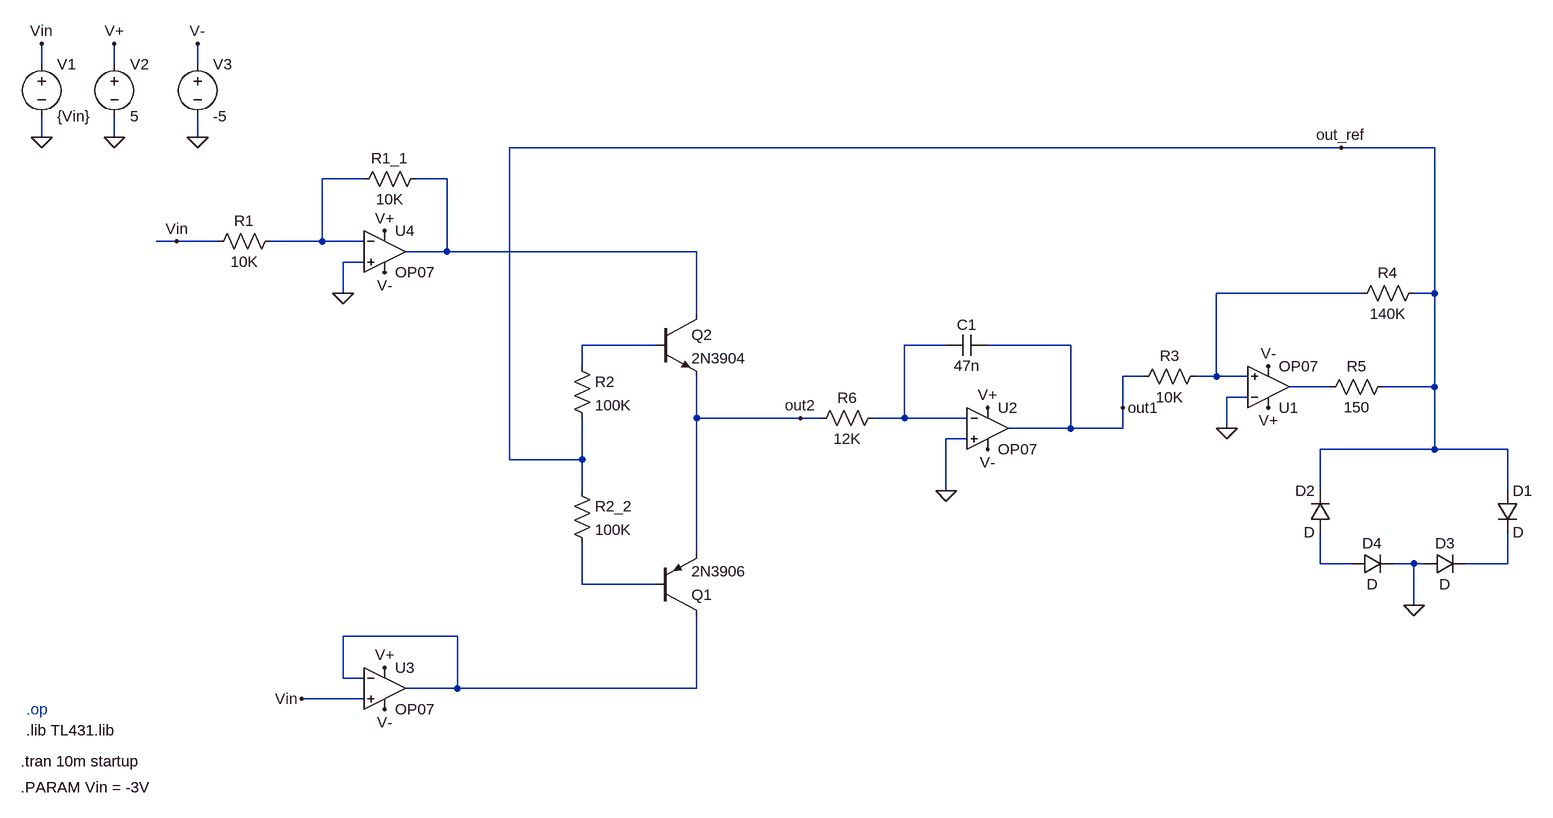
[diagram p0: schematic Proiect.asc]
Proiect.asc, the LTspice schematic file:
Version 4
SHEET 1 1724 1008
WIRE -608 -160 -608 -192
WIRE -496 -160 -496 -192
WIRE -368 -160 -368 -192
WIRE -608 -48 -608 -80
WIRE -496 -48 -496 -80
WIRE -368 -48 -368 -80
WIRE 1392 -32 112 -32
WIRE 1536 -32 1392 -32
WIRE -112 16 -176 16
WIRE 16 16 -32 16
WIRE -400 112 -432 112
WIRE -336 112 -400 112
WIRE -176 112 -176 16
WIRE -176 112 -256 112
WIRE -112 112 -176 112
WIRE 16 128 16 16
WIRE 16 128 -48 128
WIRE 400 128 16 128
WIRE -112 144 -144 144
WIRE -144 192 -144 144
WIRE 1424 192 1200 192
WIRE 1536 192 1536 -32
WIRE 1536 192 1504 192
WIRE 400 224 400 128
WIRE 336 272 224 272
WIRE 784 272 720 272
WIRE 976 272 848 272
WIRE 224 304 224 272
WIRE 1088 320 1056 320
WIRE 1200 320 1200 192
WIRE 1200 320 1168 320
WIRE 1248 320 1200 320
WIRE 1376 336 1312 336
WIRE 1536 336 1536 192
WIRE 1536 336 1456 336
WIRE 1248 352 1216 352
WIRE 1056 368 1056 320
WIRE 400 384 400 320
WIRE 560 384 400 384
WIRE 592 384 560 384
WIRE 720 384 720 272
WIRE 720 384 672 384
WIRE 816 384 720 384
WIRE 976 400 976 272
WIRE 976 400 880 400
WIRE 1056 400 1056 368
WIRE 1056 400 976 400
WIRE 1216 400 1216 352
WIRE 816 416 784 416
WIRE 1536 432 1536 336
WIRE 1536 432 1360 432
WIRE 1648 432 1536 432
WIRE 112 448 112 -32
WIRE 224 448 224 384
WIRE 224 448 112 448
WIRE 224 496 224 448
WIRE 784 496 784 416
WIRE 1360 496 1360 432
WIRE 1648 496 1648 432
WIRE 400 592 400 384
WIRE 1360 608 1360 560
WIRE 1408 608 1360 608
WIRE 1504 608 1472 608
WIRE 1520 608 1504 608
WIRE 1648 608 1648 560
WIRE 1648 608 1584 608
WIRE 224 640 224 576
WIRE 336 640 224 640
WIRE 1504 672 1504 608
WIRE 32 720 -144 720
WIRE -144 784 -144 720
WIRE -112 784 -144 784
WIRE 32 800 32 720
WIRE 32 800 -48 800
WIRE 400 800 400 688
WIRE 400 800 32 800
WIRE -112 816 -208 816
FLAG 784 496 0
FLAG -208 816 Vin
FLAG -368 -48 0
FLAG -496 -48 0
FLAG -608 -48 0
FLAG -496 -192 V+
FLAG -368 -192 V-
FLAG -608 -192 Vin
FLAG -80 768 V+
FLAG -80 96 V+
FLAG 1280 304 V-
FLAG 848 432 V-
FLAG 1280 368 V+
FLAG -80 160 V-
FLAG -80 832 V-
FLAG 848 368 V+
FLAG -144 192 0
FLAG -400 112 Vin
FLAG 1504 672 0
FLAG 1216 400 0
FLAG 1392 -32 out_ref
FLAG 1056 368 out1
FLAG 560 384 out2
DATAFLAG 192 128 ""
DATAFLAG 224 800 ""
SYMBOL res -16 0 R90
WINDOW 0 0 56 VBottom 2
WINDOW 3 32 56 VTop 2
SYMATTR InstName R1_1
SYMATTR Value 10K
SYMBOL res 1184 304 R90
WINDOW 0 0 56 VBottom 2
WINDOW 3 32 56 VTop 2
SYMATTR InstName R3
SYMATTR Value 10K
SYMBOL res -240 96 R90
WINDOW 0 0 56 VBottom 2
WINDOW 3 32 56 VTop 2
SYMATTR InstName R1
SYMATTR Value 10K
SYMBOL npn 336 224 R0
SYMATTR InstName Q2
SYMATTR Value 2N3904
SYMBOL voltage -608 -176 R0
WINDOW 123 0 0 Left 0
WINDOW 39 0 0 Left 0
SYMATTR InstName V1
SYMATTR Value {Vin}
SYMBOL voltage -496 -176 R0
WINDOW 123 0 0 Left 0
WINDOW 39 0 0 Left 0
SYMATTR InstName V2
SYMATTR Value 5
SYMBOL voltage -368 -176 R0
WINDOW 123 0 0 Left 0
WINDOW 39 0 0 Left 0
SYMATTR InstName V3
SYMATTR Value -5
SYMBOL pnp 336 688 M180
SYMATTR InstName Q1
SYMATTR Value 2N3906
SYMBOL res 1472 320 R90
WINDOW 0 0 56 VBottom 2
WINDOW 3 32 56 VTop 2
SYMATTR InstName R5
SYMATTR Value 150
SYMBOL res 1520 176 R90
WINDOW 0 0 56 VBottom 2
WINDOW 3 32 56 VTop 2
SYMATTR InstName R4
SYMATTR Value 140K
SYMBOL res 208 288 R0
SYMATTR InstName R2
SYMATTR Value 100K
SYMBOL res 208 480 R0
SYMATTR InstName R2_2
SYMATTR Value 100K
SYMBOL res 688 368 R90
WINDOW 0 0 56 VBottom 2
WINDOW 3 32 56 VTop 2
SYMATTR InstName R6
SYMATTR Value 12K
SYMBOL cap 848 256 R90
WINDOW 0 0 32 VBottom 2
WINDOW 3 32 32 VTop 2
SYMATTR InstName C1
SYMATTR Value 47n
SYMBOL OpAmps\\OP07 1280 400 M180
SYMATTR InstName U1
SYMBOL OpAmps\\OP07 848 336 R0
SYMATTR InstName U2
SYMBOL OpAmps\\OP07 -80 736 R0
SYMATTR InstName U3
SYMBOL OpAmps\\OP07 -80 64 R0
SYMATTR InstName U4
SYMBOL diode 1632 496 R0
SYMATTR InstName D1
SYMBOL diode 1376 560 R180
WINDOW 0 24 64 Left 2
WINDOW 3 24 0 Left 2
SYMATTR InstName D2
SYMBOL diode 1520 592 M90
WINDOW 0 0 32 VBottom 2
WINDOW 3 32 32 VTop 2
SYMATTR InstName D3
SYMBOL diode 1408 624 R270
WINDOW 0 32 32 VTop 2
WINDOW 3 0 32 VBottom 2
SYMATTR InstName D4
TEXT -640 912 Left 2 !.tran 10m startup
TEXT -632 864 Left 2 !.lib TL431.lib
TEXT -632 832 Left 2 ;.op
TEXT -640 952 Left 2 !.PARAM Vin = -3V

The netlist it stands for:
* Proiect.asc
R1_1 N002 N001 10K
R3 N003 out1 10K
R1 N001 Vin 10K
Q2 N002 N004 out2 0 2N3904
V1 Vin 0 {Vin}
V2 V+ 0 5
V3 V- 0 -5
Q1 N010 N009 out2 0 2N3906
R5 out_ref N006 150
R4 out_ref N003 140K
R2 N004 out_ref 100K
R2_2 out_ref N009 100K
R6 N005 out2 12K
C1 out1 N005 47n
XU1 N003 0 V+ V- N006 LT1001  ; OP07, pins In+ In- V+ V- OUT
XU2 0 N005 V+ V- out1 LT1001  ; OP07, pins In+ In- V+ V- OUT
XU3 Vin N010 V+ V- N010 LT1001  ; OP07, pins In+ In- V+ V- OUT
XU4 0 N001 V+ V- N002 LT1001  ; OP07, pins In+ In- V+ V- OUT
D1 out_ref N008 D
D2 N007 out_ref D
D3 0 N008 D
D4 N007 0 D
.model D D
.lib standard.dio
.model NPN NPN
.model PNP PNP
.lib standard.bjt
.tran 10m startup
.lib TL431.lib
* .op
.PARAM Vin = -3V
.lib LTC.lib
.backanno
.end